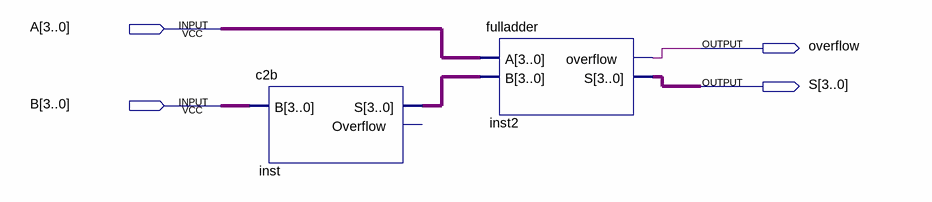
[diagram p0: schematic sheet]
// Quartus schematic subtracter.bdf as structural Verilog: 2 symbols, 4 pins
module subtracter (
  input  [3:0] A,
  input  [3:0] B,
  output overflow,
  output [3:0] S
);

  wire [3:0] inst_s;

  c2b inst (.B(B), .S(inst_s));  // open: Overflow
  fulladder inst2 (.A(A), .B(inst_s), .overflow(overflow), .S(S));
endmodule
